# EasyEDA Pro project ProPrj_trying to make a watch__2026-06-22.epro, board PCB1_8
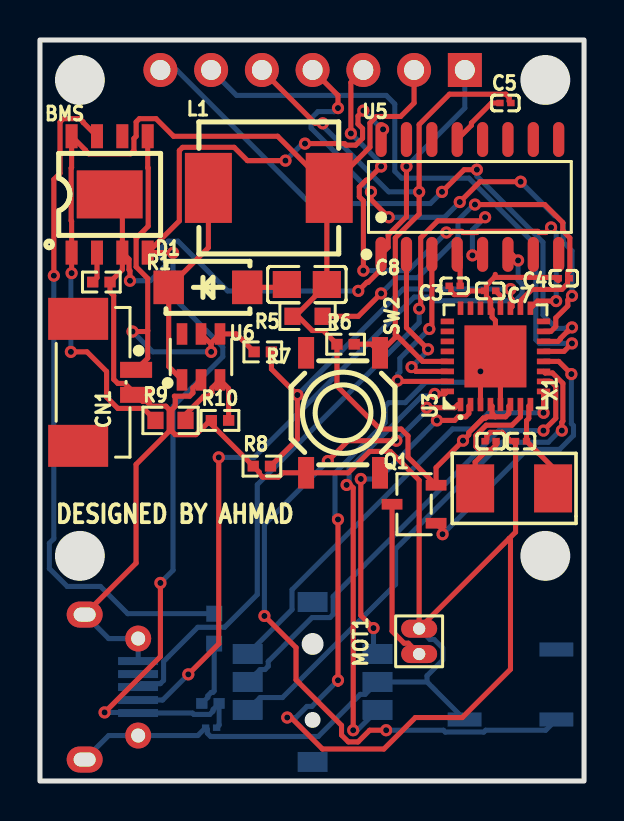
[diagram p4: board, top side]
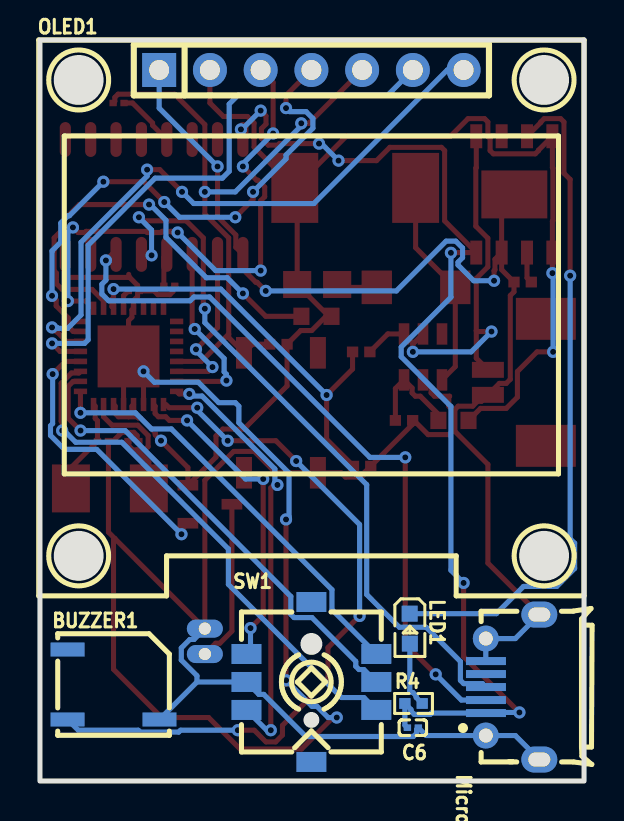
[diagram p5: board, bottom side, seen from below]

Outline 27.24 x 37.06 mm; copper layers: Top Layer, GND, VCC, Bottom Layer. Coordinates in mm from the lower left corner of the outline.
Outline path: rectangle 0,37.06 27.24,0
Stack: Top Layer 0.035mm Outer layer thickness 1oz / Dielectric1 0.2104mm 7628 RC49% 8.6mil / GND 0.0152mm Inner layer thickness / Dielectric2 1.065mm 1.1mm H/HOZ Copper / VCC 0.0152mm Inner layer thickness / Dielectric3 0.2104mm 7628 RC49% 8.6mil / Bottom Layer 0.035mm Outer layer thickness 1oz

## Design rules (mm)
spacing copperThickness1oz (default): track to track 0.102, other pairs 0.152 to 0.3
spacing copperThickness2oz: track to track 0.203, other pairs 0.152 to 0.3
spacing Plane_innerPlane: track to track 0.102, other pairs 0.152 to 0.3
spacing Copper_copperRegion: track to track 0.102, other pairs 0.152 to 0.3
track width copperThickness1oz (default): min 0.127, default 0.254, max 2.54
track width copperThickness2oz: min 0.203, default 0.254, max 2.54
differential pair differentialPair (default): width min 0.127, default 0.254, max 2.54; gap min 0.152, default 0.152
region e1 uses Copper_copperRegion
region e2 uses Copper_copperRegion
region e3 uses Copper_copperRegion
region e4 uses Copper_copperRegion
region e5 uses Copper_copperRegion
region e6 uses Copper_copperRegion
region e7 uses Copper_copperRegion
region e8 uses Copper_copperRegion
region e9 uses Copper_copperRegion
region e10 uses Copper_copperRegion
region e11 uses Copper_copperRegion
region e12 uses Copper_copperRegion
region e13 uses Copper_copperRegion
region e14 uses Copper_copperRegion
region e15 uses Copper_copperRegion
region e16 uses Copper_copperRegion
region e17 uses Copper_copperRegion
region e18 uses Copper_copperRegion
region e19 uses Copper_copperRegion
region e20 uses Copper_copperRegion
region e21 uses Copper_copperRegion
region e22 uses Copper_copperRegion
region e23 uses Copper_copperRegion
region e24 uses Copper_copperRegion
region e25 uses Copper_copperRegion
region e26 uses Copper_copperRegion
region e27 uses Copper_copperRegion
region e28 uses Copper_copperRegion

## Placement (name value [footprint] x y rotation side)
BMS  TP4056 (LX)  [ESOP-8_L4.9-W3.9-P1.27-LS6.0-BL-EP]  3.49 29.34 0 top
BUZZER1  4kHz  [BUZ-SMD_L5.0-W5.5-P4.60]  23.56 4.83 180 bottom
C1  20pF  [C0201]  24.08 17 0 top
C2  20pF  [C0201]  22.56 17 0 top
C3  100nF  [C0201]  20.76 24.77 0 top
C4  100nF  [C0201]  26.22 25.15 0 top
C5  100nF  [C0201]  23.3 33.91 0 top
C6  100nF  [C0201]  8.57 2.67 180 bottom
C7  100nF  [C0201]  22.54 24.51 0 top
C8  22uF  [C0805]  13.36 24.83 180 top
CN1  HX-1.25-2ALB wire to board connector  [CONN-SMD_2P-P1.25-MX1.25-2P-LT-1]  3.36 19.94 270 top
D1  SS14  [SMA_L4.2-W2.6-LS5.0-RD_1]  8.41 24.69 0 top
L1  22uH  [IND-SMD_L7.0-W6.6_AAPS0630]  11.46 29.66 0 top
LED1  XL-1608SURC-06  [LED0603-RD_RED]  8.72 7.62 270 bottom
MicroUSB1  MicroXNJ  [MICRO-USB-SMD_MICROXNJ_1]  3.58 4.7 90 bottom
MOT1  LCM1027A2445F  [VIBRATING-MOTOR-SMD_WELDING]  18.98 6.98 90 top
OLED1  HS96L01W4S03  [OLED-TH_HS96L01W4S03]  13.65 35.56 180 bottom
Q1  L2N7002SLLT1G  [SOT-23-3_L3.0-W1.7-P0.95-LS2.9-BR]  18.73 13.84 0 top
R1  10kΩ  [R0402]  3.07 24.95 180 top
R4  220Ω  [R0402]  8.54 3.88 180 bottom
R5  10Ω  [R0603]  13.4 23.24 0 top
R6  10kΩ  [R0402]  15.3 21.84 0 top
R7  100kΩ  [R0402]  11.16 21.46 180 top
R8  100kΩ  [R0402]  11.11 15.75 0 top
R9  68kΩ  [R0603]  6.54 18.03 0 top
R10  10kΩ  [R0402]  9.01 18.03 0 top
SW1  7*7*5-6P-L WX  [SW-SMD_8P-L7.0-W7.0-P1.40-LS7.4-TL]  13.65 4.95 180 bottom
SW2  TS5215A 250gf  [SW-SMD_4P-L5.2-W5.2-P3.70-LS6.4]  15.17 18.42 270 top
U3  ATMEGA328P-MU  [HVQFN-32_L5.0-W5.0-P0.50-TL-EP3.1]  22.8 21.24 90 top
U5  CH340C  [SOP-16_L10.0-W3.9-P1.27-LS6.0-BL]  21.52 29.21 0 top
U6  MT3608  [SOT-23-6_L2.9-W1.6-P0.95-LS2.8-BL]  8.06 21.21 0 top
X1  16MHz  [OSC-SMD_2P-L5.0-W3.2]  23.74 14.63 180 top

## Footprints (pads in the part's own frame, mm; a bottom-side part is the same pattern mirrored in y, then rotated)
BUZ-SMD_L5.0-W5.5-P4.60
  rect 1.7x0.7 smd: 1(-2.3,-1.75) 2(2.3,-1.75) 3(-2.3,1.75)
C0201
  rect 0.368x0.324 smd: 1(-0.275,0) 2(0.275,0)
C0805
  rect 1.41x1.35 smd: 1(-1,0) 2(1,0)
CONN-SMD_2P-P1.25-MX1.25-2P-LT-1
  rect 0.8x1.6 smd: 1(-0.625,1.45) 2(0.625,1.45)
  rect 2.1x3 smd: 3(-3.175,-1.45) 4(3.175,-1.45)
ESOP-8_L4.9-W3.9-P1.27-LS6.0-BL-EP
  rect 0.6x1.2 smd: 1(-1.905,-2.909) 2(-0.635,-2.909) 3(0.635,-2.909) 4(1.905,-2.909) 5(1.905,2.909) 6(0.635,2.909) 7(-0.635,2.909) 8(-1.905,2.909)
  rect 3.3x2.4 smd: 9(0,0)
HVQFN-32_L5.0-W5.0-P0.50-TL-EP3.1
  rect 0.665x0.28 smd: 1(-2.408,1.75) 2(-2.408,1.25) 3(-2.408,0.75) 4(-2.408,0.25) 5(-2.408,-0.25) 6(-2.408,-0.75) 7(-2.408,-1.25) 8(-2.408,-1.75) 17(2.408,-1.75) 18(2.408,-1.25) 19(2.408,-0.75) 20(2.408,-0.25) 21(2.408,0.25) 22(2.408,0.75) 23(2.408,1.25) 24(2.408,1.75)
  rect 0.28x0.665 smd: 9(-1.75,-2.408) 10(-1.25,-2.408) 11(-0.75,-2.408) 12(-0.25,-2.408) 13(0.25,-2.408) 14(0.75,-2.408) 15(1.25,-2.408) 16(1.75,-2.408) 25(1.75,2.408) 26(1.25,2.408) 27(0.75,2.408) 28(0.25,2.408) 29(-0.25,2.408) 30(-0.75,2.408) 31(-1.25,2.408) 32(-1.75,2.408)
  rect 3.1x3.1 smd: 33(0,0)
IND-SMD_L7.0-W6.6_AAPS0630
  rect 2.35x3.5 smd: 1(-3.025,0) 2(3.025,0)
LED0603-RD_RED
  rect 0.8x0.8 smd: 1(-0.749,-0.004) 2(0.749,0.004)
MICRO-USB-SMD_MICROXNJ_1
  rect 0.4x2 smd: 1(-1.3,1.332) 2(-0.65,1.332) 3(0,1.332) 4(0.65,1.332) 5(1.3,1.332)
  round 1.3 hole 0.7: 6(2.425,1.34) 9(-2.425,1.34)
  oval 1.3x1.8 hole 0.7x1.1: 7(3.625,-1.34) 8(-3.625,-1.34)
OLED-TH_HS96L01W4S03
  rect 1.7x1.7 hole 1: 1(-7.62,0)
  round 1.7 hole 1: 2(-5.08,0) 3(-2.54,0) 4(0,0) 5(2.54,0) 6(5.08,0) 7(7.62,0)
OSC-SMD_2P-L5.0-W3.2
  rect 1.9x2.4 smd: 1(-1.95,0) 2(1.95,0)
R0402
  rect 0.566x0.54 smd: 1(-0.433,0) 2(0.433,0)
R0603
  rect 0.806x0.864 smd: 1(-0.753,0) 2(0.753,0)
SMA_L4.2-W2.6-LS5.0-RD_1
  rect 1.52x1.68 smd: 1(-1.965,0) 2(1.965,0)
SOP-16_L10.0-W3.9-P1.27-LS6.0-BL
  oval 0.56x1.745 smd: 1(-4.445,-2.873) 2(-3.175,-2.873) 3(-1.905,-2.873) 4(-0.635,-2.873) 5(0.635,-2.873) 6(1.905,-2.873) 7(3.175,-2.873) 8(4.445,-2.873) 9(4.445,2.873) 10(3.175,2.873) 11(1.905,2.873) 12(0.635,2.873) 13(-0.635,2.873) 14(-1.905,2.873) 15(-3.175,2.873) 16(-4.445,2.873)
SOT-23-3_L3.0-W1.7-P0.95-LS2.9-BR
  rect 1.038x0.532 smd: 1(1.101,-0.95) 2(1.101,0.95) 3(-1.101,0)
SOT-23-6_L2.9-W1.6-P0.95-LS2.8-BL
  rect 0.532x1.072 smd: 1(-0.95,-1.149) 2(0,-1.149) 3(0.95,-1.149) 4(0.95,1.149) 5(0,1.149) 6(-0.95,1.149)
SW-SMD_4P-L5.2-W5.2-P3.70-LS6.4
  rect 1.58x0.8 smd: 1(-3,1.85) 2(3,1.85) 3(-3,-1.85) 4(3,-1.85)
SW-SMD_8P-L7.0-W7.0-P1.40-LS7.4-TL
  rect 1.5x1 smd: 1(-3.25,1.4) 2(-3.25,0) 3(-3.25,-1.4) 4(3.25,-1.4) 5(3.25,0) 6(3.25,1.4) 7(0,4) 8(0,-4)
VIBRATING-MOTOR-SMD_WELDING
  oval 0.9x1.8 hole 0.61: 1(-0.635,0) 2(0.635,0)

## Nets
As in the schematic.

Pads without a net: BMS 6; BUZZER1 3; CN1 3 4; MicroUSB1 4; SW1 7 8; SW2 2 3; U3 16 22 23 24 25 26; U5 7 8 9 10 11 12 14 15; U6 6

## Via types
v1: diameter 0.61, hole 0.305, Top Layer to Bottom Layer, 68 vias

## Routing (per net, layer and track width the routed paths; a pad name or vN(x,y) marks a point on that pad's centre or on a via; arc(x,y) is an arc through that point)
+5V: length 54.4
  Top Layer w0.254: v1(6.66,26.42) 6.65,26.43 BMS.4 6.98,28.01 6.98,31.53 7.14,31.69 9.72,31.69 10.39,31.03 v1(12.29,31.03) ; v1(6.03,9.91) 6.03,6.22 v1(3.24,3.43) ; U5.16 17.18,32.18 v1(17.18,32.59) ; v1(16.19,33.53) 15.92,33.26 15.92,32.86 16.15,32.63 16.15,32.14 15.81,31.8 15.32,31.8 15.25,31.88 v1(13.27,31.88)
  Bottom Layer w0.254: v1(3.24,3.43) 4.88,3.43 MicroUSB1.1 7.63,3.4 7.7,3.33 8.5,3.33 8.66,3.49 8.66,3.57 R4.1 8.97,2.79 C6.1 ; v1(12.29,31.03) 13.14,31.88 v1(13.27,31.88) ; v1(6.03,9.91) 6.66,10.54 6.66,18.73 9.15,21.22 9.15,21.7 6.66,24.19 v1(6.66,26.42) ; v1(17.18,32.59) 17.13,32.59 v1(16.19,33.53)
AVCC: length 21.6
  Top Layer w0.254: R5.2 15.94,23.24 v1(17.08,24.38) ; v1(21.78,28.83) 25.27,28.83 26.17,27.93 26.17,27.52 26.53,27.16 26.53,25.51 26.41,25.4 26.41,25.23 C4.2 26.41,25.06 26.41,24.87 26.13,24.59 24.63,24.59 24.05,24.01 U3.18
  Bottom Layer w0.254: v1(21.78,28.83) 21.72,28.83 20.93,28.04 20.93,27.19 18.91,25.17 17.87,25.17 v1(17.08,24.38)
GND: length 182.7
  Top Layer w0.254: v1(18.35,30.73) 18.35,28.22 17.43,27.31 17.43,26.69 U5.1 17.08,25.59 16.43,24.94 16.37,24.94 v1(15.94,24.51) ; v1(12.38,3.17) 12.57,3.17 14.14,1.6 17.22,1.6 18.79,3.17 21.14,3.17 23.56,5.59 23.56,12.06 23.49,12.13 ; U3.3 v1(22.05,20.49) U3.33 ; 22.75,25.19 25.78,25.19 25.95,25.02 ; 22.75,25.19 22.35,24.79 22.35,24.6 C7.1 ; 22.75,25.19 22.79,25.23 22.79,25.34 ; BMS.3 4.12,28.7 BMS.9 ; BMS.3 4.12,25.57 R1.1 3.51,24.46 3.69,24.28 3.69,20.09 3.9,19.89 4.24,19.89 CN1.2 5.14,18.99 5.33,18.99 5.58,18.75 6.3,18.75 6.47,18.58 6.47,17.49 4.81,15.83 4.81,10.9 MicroUSB1.7 ; BMS.3 4.46,26.09 4.46,25.57 4.51,25.52 v1(4.51,25.02) ; U3.33 22.8,23.03 22.63,23.2 22.63,23.56 U3.21 22.55,24.03 22.35,24.23 22.35,24.43 C7.1 ; U3.33 23.05,20.99 U3.5 ; C7.1 21.52,24.51 21.34,24.32 20.74,24.32 20.57,24.49 20.57,24.68 C3.1 ; 23.49,12.13 23.81,12.45 C1.1 23.58,17 23.13,17.44 22.53,17.44 22.37,17.28 22.37,17.08 C2.1 ; 23.49,12.13 MOT1.2 18.98,15.04 17.54,16.48 16.51,16.48 15.44,15.42 SW2.4 12.16,15.42 11.94,15.2 11.14,15.2 10.98,15.36 10.98,15.44 R8.1 8.58,17.85 R10.1 8.52,18.03 7.81,17.32 6.77,17.32 6.61,17.49 6.61,18.58 6.77,18.75 6.77,19.2 6.73,19.25 7.49,19.25 7.66,19.41 7.66,19.66 U6.2 ; v1(14.92,13.08) 14.92,4.83
  Bottom Layer w0.254: v1(12.38,3.17) 12.81,3.17 13.37,3.73 13.61,3.73 v1(14.92,5.04) ; OLED1.1 21.27,33.66 v1(18.35,30.73) ; v1(14.92,13.08) 14.77,13.23 14.77,15.4 17.28,17.91 17.28,18.74 17.46,18.92 18.29,18.92 19.31,19.94 21.51,19.94 v1(22.05,20.49) ; BUZZER1.2 19.38,4.95 ; 19.38,4.95 SW1.2 16.28,4.33 16.03,4.33 13.93,2.23 8.54,2.23 8.38,2.39 8.38,2.58 C6.2 7.9,2.27 MicroUSB1.9 3.44,2.27 MicroUSB1.8 ; 19.38,4.95 19.38,5.26 20.16,6.05 20.16,6.65 19.74,7.08 19.53,7.08 MOT1.2 ; v1(15.94,24.51) 9.4,24.51 6.91,27 6.42,27 6.08,26.66 6.08,26.17 6.31,25.95 6.31,25.81 5.52,25.02 v1(4.51,25.02) ; 4.91,6 4.92,6.01 MicroUSB1.6 3.44,7.12 MicroUSB1.7
VCC: length 68.4
  Top Layer w0.254: R9.1 5.18,18.64 3.9,18.64 3.34,19.2 3.34,20.48 2.35,21.46 v1(1.55,21.46) ; 22.8,18.22 22.63,18.38 22.63,18.75 U3.4 ; 22.8,18.22 23.31,18.22 23.47,18.38 23.47,18.75 U3.6 ; 22.8,18.22 22.37,18.22 22.31,18.15 22.19,18.15 21.47,17.42 21.47,17.31 v1(21.18,17.02) 19.83,15.67 Q1.2 18.43,16.2 18.43,17.26 18.08,17.6 17.02,17.6 14.87,19.76 R6.1 14.18,22.53 13.63,22.53 12.92,23.24 12.77,23.24 ; 12.77,23.24 C8.1 14.36,29.54 L1.2 ; 12.77,23.24 R5.1 ; L1.2 16.52,31.7 16.52,32.91 16.85,33.23 18.05,33.23 18.73,33.91 OLED1.2 ; L1.2 11.9,32.25 6.69,32.25 5.81,33.12 4.98,33.12 4.82,32.96 4.82,32.25 4.7,32.13 4.7,31.53 4.54,31.37 2.44,31.37 2.28,31.53 2.28,31.55 BMS.8 1.59,30.68 1.56,30.65 1.56,28.02 1.59,28 BMS.1 v1(1.59,25.4)
  Bottom Layer w0.254: v1(1.59,25.4) 1.55,25.36 v1(1.55,21.46)
ADC6: length 20.7
  Top Layer w0.254: R8.2 12.89,17.09 v1(12.89,19.3) 11.59,20.6 R7.1 ; U3.19 23.63,23.72 23.63,24.09 23.56,24.17 v1(23.56,24.6)
  Bottom Layer w0.254: v1(23.56,24.6) 18.19,24.6 v1(12.89,19.3)
BAT+: length 21.4
  Top Layer w0.254: 5.4,22.52 5.35,22.48 v1(4.63,22.48) ; 5.4,22.52 5.4,25.13 4.82,25.71 4.82,27.14 5.42,27.75 5.42,30.65 5.4,30.68 BMS.5 ; 5.4,22.52 5.4,21.15 CN1.1 ; 8.57,21.85 8.57,21.92 U6.4 9.83,22.36 R7.2 ; 8.57,21.85 v1(8.57,21.46) ; 8.57,21.85 U6.5
  Bottom Layer w0.254: v1(4.63,22.48) 5.65,21.46 v1(8.57,21.46)
BAT-LED: length 34
  Top Layer w0.254: v1(0.7,25.27) 0.7,30.09 1.01,30.4 1.01,32.96 1.17,33.12 2,33.12 2.16,32.96 2.16,32.94 2.85,32.25
  Bottom Layer w0.254: v1(0.7,25.27) 0.7,12.12 0.47,11.89 0.47,10.63 1.37,9.73 3.03,9.73 4.39,8.37 LED1.1
CS: length 31.7
  Top Layer w0.254: 25.08,21.99 25.94,21.99 26.05,22.1 26.05,22.13 26.39,22.47 26.42,22.47 v1(26.63,22.69) ; v1(20.13,29.46) 21.24,30.58 v1(21.87,30.58)
  Bottom Layer w0.254: v1(20.13,29.46) 19.54,28.88 13.53,28.88 6.85,35.56 5.9,35.56 ; v1(21.87,30.58) 21.87,30.25 25.18,26.94 25.18,23.31 25.85,22.64 26.34,22.64 26.38,22.69 v1(26.63,22.69)
D+: length 36
  Top Layer w0.254: v1(22.29,28.19) 22.11,28.02 19.91,28.02 19.06,27.16 19.06,23.7 v1(18.98,23.62) ; v1(21.65,26.29) 22.11,26.29 U5.5
  Bottom Layer w0.254: v1(22.29,28.19) 21.65,27.56 v1(21.65,26.29) ; v1(18.98,23.62) 18.98,22.92 10.88,14.82 10.88,9.33 9.24,7.69 7.9,7.69 6.19,5.98 6.19,5.03 6.03,4.87 5.08,4.87 MicroUSB1.3
D-: length 35.7
  Top Layer w0.254: v1(7.43,5.33) 8.95,6.86 v1(8.95,16.19) ; U5.6 23.63,26.34 v1(23.94,26.03)
  Bottom Layer w0.254: v1(7.43,5.33) 6.14,4.05 MicroUSB1.2 ; v1(8.95,16.19) 10.72,16.19 18.74,24.21 19.53,24.21 19.72,24.02 23.8,24.02 24.14,24.36 24.14,24.84 23.94,25.05 v1(23.94,26.03)
DC: length 30.1
  Top Layer w0.254: U3.13 26.23,21.49 v1(26.63,21.89)
  Bottom Layer w0.254: v1(26.63,21.89) 25.01,21.89 24.83,22.07 24.83,26.8 21.47,30.15 18.11,30.15 17.76,30.49 17.76,33.86 17.33,34.29 9.84,34.29 OLED1.6
FB: length 5.1
  Top Layer w0.254: R9.2 7.29,18.34 8.2,19.25 8.44,19.25 8.61,19.41 8.61,19.66 U6.3 9.44,19.63 R10.2
MOSI: length 27.3
  Top Layer w0.254: OLED1.4 14.92,34.29 v1(14.92,33.66) ; v1(21.02,28.96) 22.03,29.97 v1(24.06,29.97) ; v1(17.46,28.19) 16.57,29.08 v1(16.57,29.46) ; U3.15 25.58,22.49 25.82,22.73 25.82,23.16 26.43,23.76 26.43,24.06 v1(26.63,24.27)
  Bottom Layer w0.254: v1(14.92,33.66) 14.74,33.48 13.92,33.48 13.57,33.14 13.57,32.65 14.92,31.31 14.92,31.12 v1(16.57,29.46) ; v1(24.06,29.97) 25.77,28.27 25.83,28.27 26.2,27.9 26.2,26.95 26.63,26.51 v1(26.63,24.27) ; v1(21.02,28.96) 20.25,28.19 v1(17.46,28.19)
PIN2: length 21.6
  Top Layer w0.254: 15.41,14.94 15.68,14.66 v1(15.68,2.54) ; U3.32 20.27,19.36 v1(19.76,19.36)
  Bottom Layer w0.254: v1(15.35,14.81) 15.48,14.94 15.48,15.61 19.12,19.25 19.8,19.25 19.8,19.32 v1(19.76,19.36) ; v1(15.68,2.54) 15.89,2.54 SW1.3
PIN3: length 35.8
  Top Layer w0.254: v1(11.24,8.26) 12.82,6.67 12.82,5.06 15.1,2.78 15.1,2.3 15.44,1.96 15.92,1.96 16.51,2.54 v1(17.33,2.54) ; v1(17.84,17.02) 15.43,17.02 v1(14.41,16) ; 20.93,18.83 20.77,18.67 v1(19.37,18.67)
  Bottom Layer w0.254: v1(17.84,17.02) 19.37,18.54 v1(19.37,18.67) ; v1(11.24,8.26) 11.24,12.83 v1(14.41,16) ; v1(17.33,2.54) 20.2,2.54 20.29,2.45 22.22,2.45 22.31,2.54 25.32,2.54 BUZZER1.1
PIN4: length 16.2
  Top Layer w0.254: v1(16.7,7.65) 16.06,8.28 v1(16.06,15.11) ; v1(19.87,18.03) 20.76,18.03 20.94,18.22 21.31,18.22 21.47,18.38 21.47,18.75 U3.2
  Bottom Layer w0.254: SW1.1 16.7,6.56 16.7,7.49 ; v1(16.06,15.11) 16.94,15.11 v1(19.87,18.03)
PIN5: length 21.5
  Top Layer w0.254: U3.9 v1(25.21,18.42)
  Bottom Layer w0.254: v1(25.21,18.42) 22.46,18.42 21.65,17.61 20.66,17.61 12.62,9.57 12.62,8.57 SW1.6
PIN6: length 23.9
  Top Layer w0.254: v1(25.21,17.53) 25.82,18.14 25.82,19.74 25.58,19.99 U3.10
  Bottom Layer w0.254: v1(25.21,17.53) 22.97,17.53 14.68,9.23 14.68,8.34 14.52,8.17 13.62,8.17 11.43,5.98 11.43,5.74 11.27,5.57 11.02,5.57 SW1.5
PIN7: length 26.2
  Top Layer w0.254: U3.11 25.29,20.4 25.66,20.4 26.18,19.89 26.18,17.99 26.13,17.94 v1(26.13,17.53)
  Bottom Layer w0.254: v1(26.13,17.53) 26.03,17.53 25.45,16.94 23.14,16.94 17.81,11.61 17.81,9.84 12.14,4.17 11.02,4.17 SW1.4
PIN8: length 14.1
  Top Layer w0.254: v1(26.6,20.35) 25.97,20.99 U3.12 ; Q1.1 20.16,12.57 v1(20.16,12.34)
  Bottom Layer w0.254: v1(26.6,20.35) 26.6,17.88 26.71,17.77 26.71,17.28 26.01,16.59 24.4,16.59 v1(20.16,12.34)
PROG: length 1.6
  Top Layer w0.254: 2.85,26.43 2.85,25.17 R1.2
RESET: length 32.8
  Top Layer w0.254: 17.79,22.35 17.79,27.16 18.98,28.36 v1(18.98,29.46) 18.98,32.83 20.5,34.35 23.33,34.35 23.49,34.19 23.49,33.99 C5.2 ; 17.79,22.35 19.16,20.99 U3.29 ; 17.79,22.35 17.79,22.18 SW2.1 16.59,21.84 R6.2 ; OLED1.5 13.78,32.89 v1(14.16,32.89)
  Bottom Layer w0.254: 18.86,29.46 17.46,29.46 14.03,32.89
RXD: length 8.3
  Top Layer w0.254: U5.2 18.35,22.67 v1(19.43,21.59) ; U3.30 18.82,20.49 v1(18.6,20.7)
  Bottom Layer w0.254: v1(18.6,20.7) 19.43,21.53 v1(19.43,21.59)
SCK: length 27.1
  Top Layer w0.254: v1(25.59,27.69) 25.33,27.43 24.99,27.43 24.93,27.49 21.93,27.49 21.87,27.43 21.18,27.43 21.12,27.49 20.66,27.49 20.6,27.43 v1(20.35,27.43) ; v1(16.19,25.53) 16.19,29.02 15.99,29.22 15.99,29.71 16.33,30.05 16.39,30.05 v1(17.08,30.73) ; U3.17 24.91,24 v1(25.84,24) ; OLED1.3 15.57,34.94 v1(15.57,32.39)
  Bottom Layer w0.254: v1(25.84,24) 25.84,27.43 v1(25.59,27.69) ; v1(15.57,32.39) 17.08,30.87 v1(17.08,30.73) ; v1(16.19,25.53) 18.44,25.53 v1(20.35,27.43)
SW: length 10.7
  Top Layer w0.254: U6.1 6.45,20.73 D1.1 8.43,26.67 L1.1
TXD: length 9.5
  Top Layer w0.254: v1(17.9,20.03) 17.94,19.99 U3.31 ; 19.75,26.34 19.62,26.21 19.62,22.61
  Bottom Layer w0.254: v1(19.49,22.61) 18.02,21.13 18.02,20.46 17.9,20.34 v1(17.9,20.03)
XTAL1: length 7.5
  Top Layer w0.254: 22.39,16.56 21.99,16.56 21.82,16.72 21.82,17.28 22.34,17.8 23.63,17.8 24.05,18.22 U3.7 ; 22.39,16.56 21.79,15.95 21.79,14.51 ; 22.39,16.56 22.59,16.56 22.83,16.81 C2.2
XTAL2: length 5
  Top Layer w0.254: 25.69,14.51 25.69,15.67 C1.2 24.36,18.02 24.47,18.13 24.47,18.75 U3.8
$1N13873: length 3.3
  Bottom Layer w0.254: LED1.2 8.72,4.5 8.65,4.43 8.57,4.43 8.41,4.26 8.41,4.18 R4.2
$1N14986: length 1.6
  Top Layer w0.254: C3.2 21.04,26.19 U5.4
$1N16662: length 8.2
  Top Layer w0.254: Q1.3 17.63,7.49 18.23,6.89 18.44,6.89 MOT1.1
$1N17222: length 3
  Top Layer w0.254: C5.1 22.6,33.91 21.6,32.91 21.6,32.79 U5.13
$1N17389: length 1
  Top Layer w0.254: C7.2 23.05,24.27 U3.20
$1N19770: length 2
  Top Layer w0.254: C8.2 12.22,24.69 D1.2

## Copper pours and planes (outline as drawn; the poured copper is in the pictures)
GND on GND: 0.26,36.8 26.98,36.8 26.98,0.26 0.26,0.26
VCC on VCC: 0.26,36.8 26.98,36.8 26.98,0.26 0.26,0.26

Small or netless copper shapes (teardrops, artwork), in the pictures only: 22 on GND, 4 on VCC

## Text on the board
Top Silkscreen Layer: DESIGNED BY AHMAD
